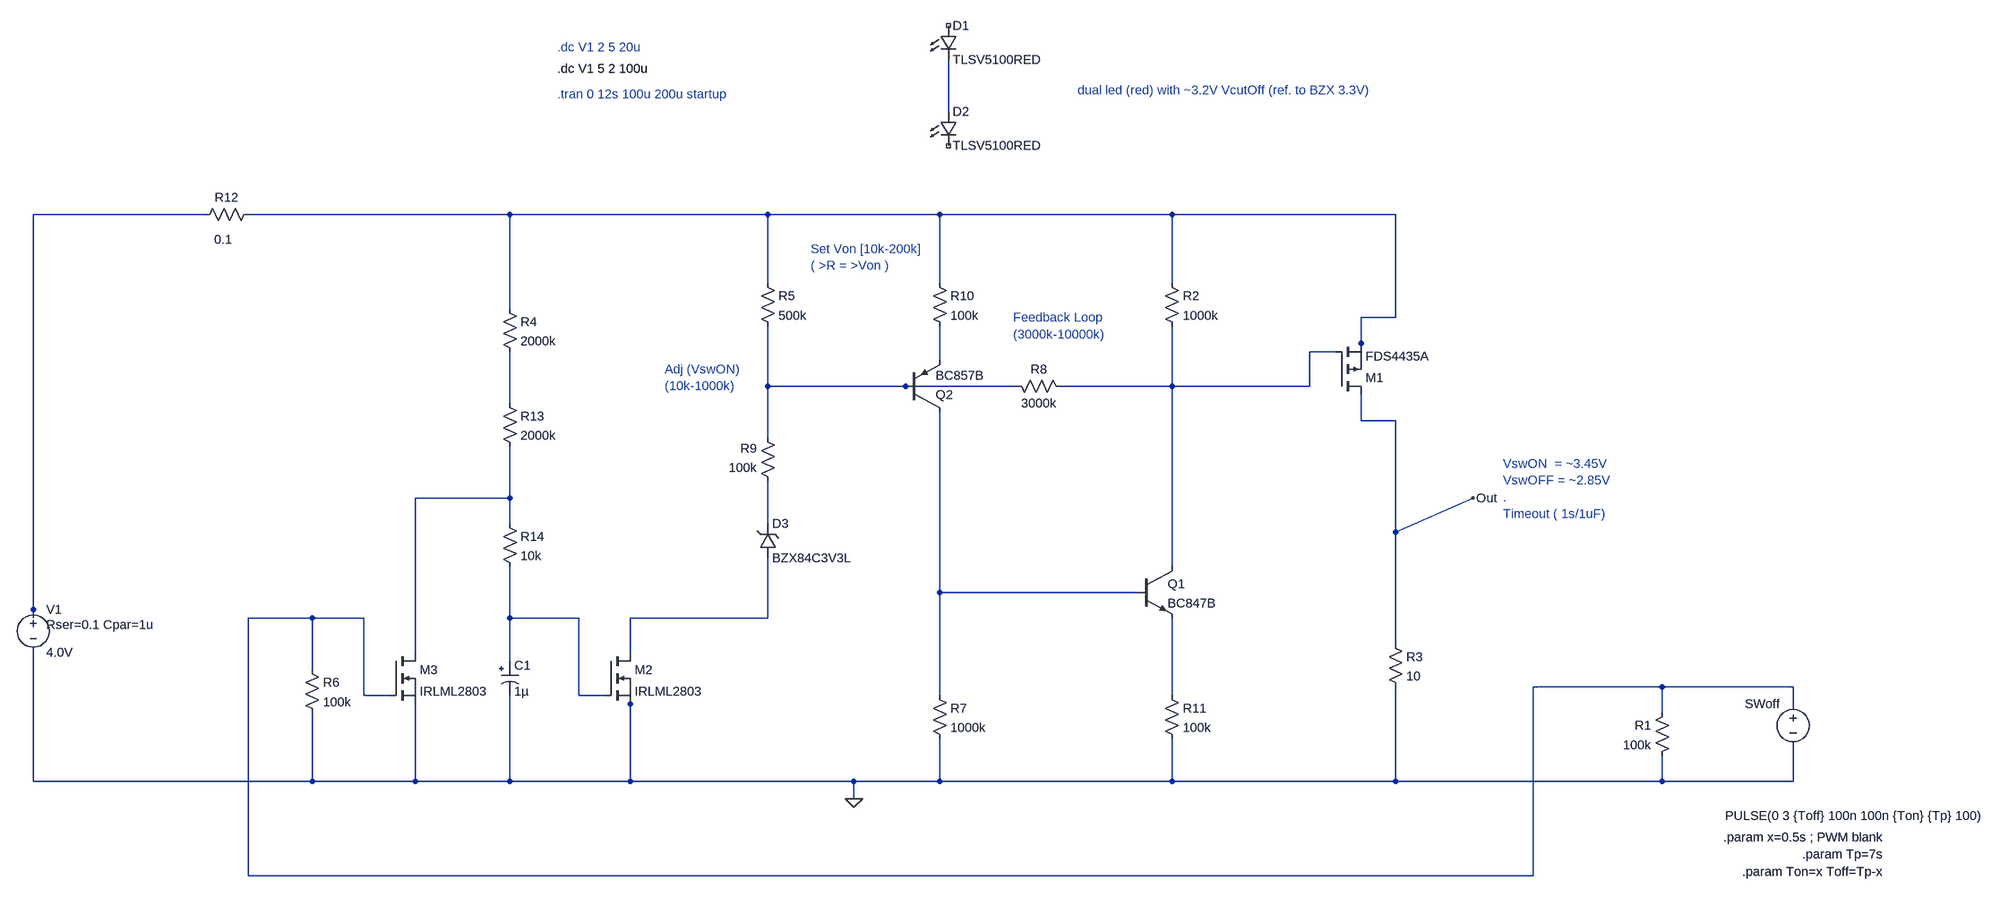
[diagram p0: schematic V0_SW21p.asc]
V0_SW21p.asc, the LTspice schematic file:
Version 4
SHEET 1 2884 768
WIRE 928 -752 928 -848
WIRE -480 -560 -800 -560
WIRE 112 -560 -400 -560
WIRE 592 -560 112 -560
WIRE 912 -560 592 -560
WIRE 1344 -560 912 -560
WIRE 1760 -560 1344 -560
WIRE 592 -432 592 -560
WIRE 912 -432 912 -560
WIRE 1344 -432 1344 -560
WIRE 112 -384 112 -560
WIRE 1760 -368 1760 -560
WIRE 1760 -368 1696 -368
WIRE 1696 -320 1696 -368
WIRE 1648 -304 1600 -304
WIRE 912 -288 912 -352
WIRE 1696 -272 1696 -320
WIRE 592 -240 592 -352
WIRE 848 -240 592 -240
WIRE 1056 -240 848 -240
WIRE 1344 -240 1344 -352
WIRE 1344 -240 1136 -240
WIRE 1600 -240 1600 -304
WIRE 1600 -240 1344 -240
WIRE 112 -208 112 -304
WIRE 1696 -176 1696 -224
WIRE 1760 -176 1696 -176
WIRE 592 -144 592 -240
WIRE 112 -32 112 -128
WIRE 112 -32 -64 -32
WIRE 112 16 112 -32
WIRE 592 16 592 -64
WIRE 1760 32 1760 -176
WIRE 1760 32 1904 -32
WIRE 1344 96 1344 -240
WIRE 912 144 912 -192
WIRE 1280 144 912 144
WIRE -800 176 -800 -560
WIRE -800 192 -800 176
WIRE -256 192 -400 192
WIRE -160 192 -256 192
WIRE 112 192 112 96
WIRE 240 192 112 192
WIRE 592 192 592 80
WIRE 592 192 336 192
WIRE 1760 240 1760 32
WIRE -64 256 -64 -32
WIRE 336 256 336 192
WIRE 112 272 112 192
WIRE -256 288 -256 192
WIRE 2256 320 2016 320
WIRE 2528 320 2256 320
WIRE -160 336 -160 192
WIRE -112 336 -160 336
WIRE 240 336 240 192
WIRE 288 336 240 336
WIRE 912 336 912 144
WIRE 1344 336 1344 192
WIRE 336 352 336 320
WIRE 2528 352 2528 320
WIRE 2256 368 2256 320
WIRE -800 496 -800 256
WIRE -256 496 -256 368
WIRE -256 496 -800 496
WIRE -64 496 -64 352
WIRE -64 496 -256 496
WIRE 112 496 112 336
WIRE 112 496 -64 496
WIRE 336 496 336 352
WIRE 336 496 112 496
WIRE 752 496 336 496
WIRE 912 496 912 416
WIRE 912 496 752 496
WIRE 1344 496 1344 416
WIRE 1344 496 912 496
WIRE 1760 496 1760 320
WIRE 1760 496 1344 496
WIRE 2256 496 2256 448
WIRE 2256 496 1760 496
WIRE 2528 496 2528 432
WIRE 2528 496 2256 496
WIRE 752 528 752 496
WIRE -400 672 -400 192
WIRE 2016 672 2016 320
WIRE 2016 672 -400 672
FLAG 752 528 0
FLAG 1904 -32 Out
SYMBOL res 576 -448 R0
SYMATTR InstName R5
SYMATTR Value 500k
SYMBOL res 1744 224 R0
SYMATTR InstName R3
SYMATTR Value 10
SYMBOL voltage -800 160 R0
WINDOW 123 0 0 Left 0
WINDOW 39 24 44 Left 2
SYMATTR SpiceLine Rser=0.1 Cpar=1u
SYMATTR InstName V1
SYMATTR Value 4.0V
SYMBOL pnp 848 -192 M180
SYMATTR InstName Q2
SYMATTR Value BC857B
SYMBOL res 896 320 R0
SYMATTR InstName R7
SYMATTR Value 1000k
SYMBOL npn 1280 96 R0
SYMATTR InstName Q1
SYMATTR Value BC847B
SYMBOL res 1328 -448 R0
SYMATTR InstName R2
SYMATTR Value 1000k
SYMBOL res 1040 -256 M90
WINDOW 0 0 56 VBottom 2
WINDOW 3 32 56 VTop 2
SYMATTR InstName R8
SYMATTR Value 3000k
SYMBOL res 608 -48 R180
WINDOW 0 36 76 Left 2
WINDOW 3 36 40 Left 2
SYMATTR InstName R9
SYMATTR Value 100k
SYMBOL res 896 -448 R0
SYMATTR InstName R10
SYMATTR Value 100k
SYMBOL res -384 -576 R90
WINDOW 0 0 56 VBottom 2
WINDOW 3 47 62 VTop 2
SYMATTR InstName R12
SYMATTR Value 0.1
SYMBOL res 1328 320 R0
SYMATTR InstName R11
SYMATTR Value 100k
SYMBOL LED 912 -912 R0
SYMATTR InstName D1
SYMATTR Value TLSV5100RED
SYMBOL LED 912 -752 R0
SYMATTR InstName D2
SYMATTR Value TLSV5100RED
SYMBOL zener 576 80 M180
WINDOW 0 24 64 Left 2
WINDOW 3 24 0 Left 2
SYMATTR InstName D3
SYMATTR Value BZX84C3V3L
SYMATTR Description Diode
SYMATTR Type diode
SYMBOL pmos 1648 -224 M180
SYMATTR InstName M1
SYMATTR Value FDS4435A
SYMBOL voltage 2528 336 M0
WINDOW 3 -353 224 Left 2
WINDOW 123 0 0 Left 0
WINDOW 39 0 0 Left 0
SYMATTR Value PULSE(0 3 {Toff} 100n 100n {Ton} {Tp} 100)
SYMATTR InstName SWoff
SYMBOL res 2272 352 M0
SYMATTR InstName R1
SYMATTR Value 100k
SYMBOL nmos 288 256 R0
SYMATTR InstName M2
SYMATTR Value IRLML2803
SYMBOL res 96 -400 R0
SYMATTR InstName R4
SYMATTR Value 2000k
SYMBOL res 96 -224 R0
SYMATTR InstName R13
SYMATTR Value 2000k
SYMBOL polcap 96 272 R0
WINDOW 3 24 56 Left 2
SYMATTR InstName C1
SYMATTR Value 1µ
SYMATTR Description Capacitor
SYMATTR Type cap
SYMATTR SpiceLine V=4 Irms=0 Rser=7.5 Lser=0 mfg="AVX" pn="TAJA475K004" type="Tantalum"
SYMBOL nmos -112 256 R0
SYMATTR InstName M3
SYMATTR Value IRLML2803
SYMBOL res -272 272 R0
SYMATTR InstName R6
SYMATTR Value 100k
SYMBOL res 96 0 R0
SYMATTR InstName R14
SYMATTR Value 10k
TEXT 200 -872 Left 2 ;.dc V1 2 5 20u
TEXT 200 -832 Left 2 !.dc V1 5 2 100u
TEXT 672 -496 Left 2 ;Set Von [10k-200k]\n( >R = >Von )
TEXT 1048 -368 Left 2 ;Feedback Loop\n(3000k-10000k)
TEXT 1960 -96 Left 2 ;VswON  = ~3.45V\nVswOFF = ~2.85V\n.\nTimeout ( 1s/1uF)
TEXT 400 -272 Left 2 ;Adj (VswON)\n(10k-1000k)
TEXT 200 -784 Left 2 ;.tran 0 12s 100u 200u startup
TEXT 2696 600 Right 2 !.param x=0.5s ; PWM blank
TEXT 2696 664 Right 2 !.param Ton=x Toff=Tp-x
TEXT 2696 632 Right 2 !.param Tp=7s
TEXT 1168 -792 Left 2 ;dual led (red) with ~3.2V VcutOff (ref. to BZX 3.3V)

The netlist it stands for:
* V0_SW21p.asc
R5 N003 N006 500k
R3 Out 0 10
V1 N002 0 4.0V Rser=0.1 Cpar=1u
Q2 N010 N006 N005 0 BC857B
R7 N010 0 1000k
Q1 N004 N010 N014 0 BC847B
R2 N003 N004 1000k
R8 N006 N004 3000k
R9 N009 N006 100k
R10 N003 N005 100k
R12 N003 N002 0.1
R11 N014 0 100k
D1 NC_01 N001 TLSV5100RED
D2 N001 NC_02 TLSV5100RED
D3 N013 N009 BZX84C3V3L
M1 Out N004 N003 N003 FDS4435A
V§SWoff N011 0 PULSE(0 3 {Toff} 100n 100n {Ton} {Tp} 100)
R1 N011 0 100k
M2 N013 N012 0 0 IRLML2803
R4 N003 N007 2000k
R13 N007 N008 2000k
C1 N012 0 1µ V=4 Irms=0 Rser=7.5 Lser=0 mfg="AVX" pn="TAJA475K004" type="Tantalum"
M3 N008 N011 0 0 IRLML2803
R6 N011 0 100k
R14 N008 N012 10k
.model D D
.lib standard.dio
.model NPN NPN
.model PNP PNP
.lib standard.bjt
.model NMOS NMOS
.model PMOS PMOS
.lib standard.mos
* .dc V1 2 5 20u
.dc V1 5 2 100u
* Set Von [10k-200k]
* ( >R = >Von )
* Feedback Loop
* (3000k-10000k)
* VswON  = ~3.45V
* VswOFF = ~2.85V
* .
* Timeout ( 1s/1uF)
* Adj (VswON)
* (10k-1000k)
* .tran 0 12s 100u 200u startup
.param x=0.5s ; PWM blank
.param Ton=x Toff=Tp-x
.param Tp=7s
* dual led (red) with ~3.2V VcutOff (ref. to BZX 3.3V)
.backanno
.end